# EAGLE design 16nMod4 (EAGLE 6.6.0)

## Sheet 1 of 2: Faders / Jacks / Digital
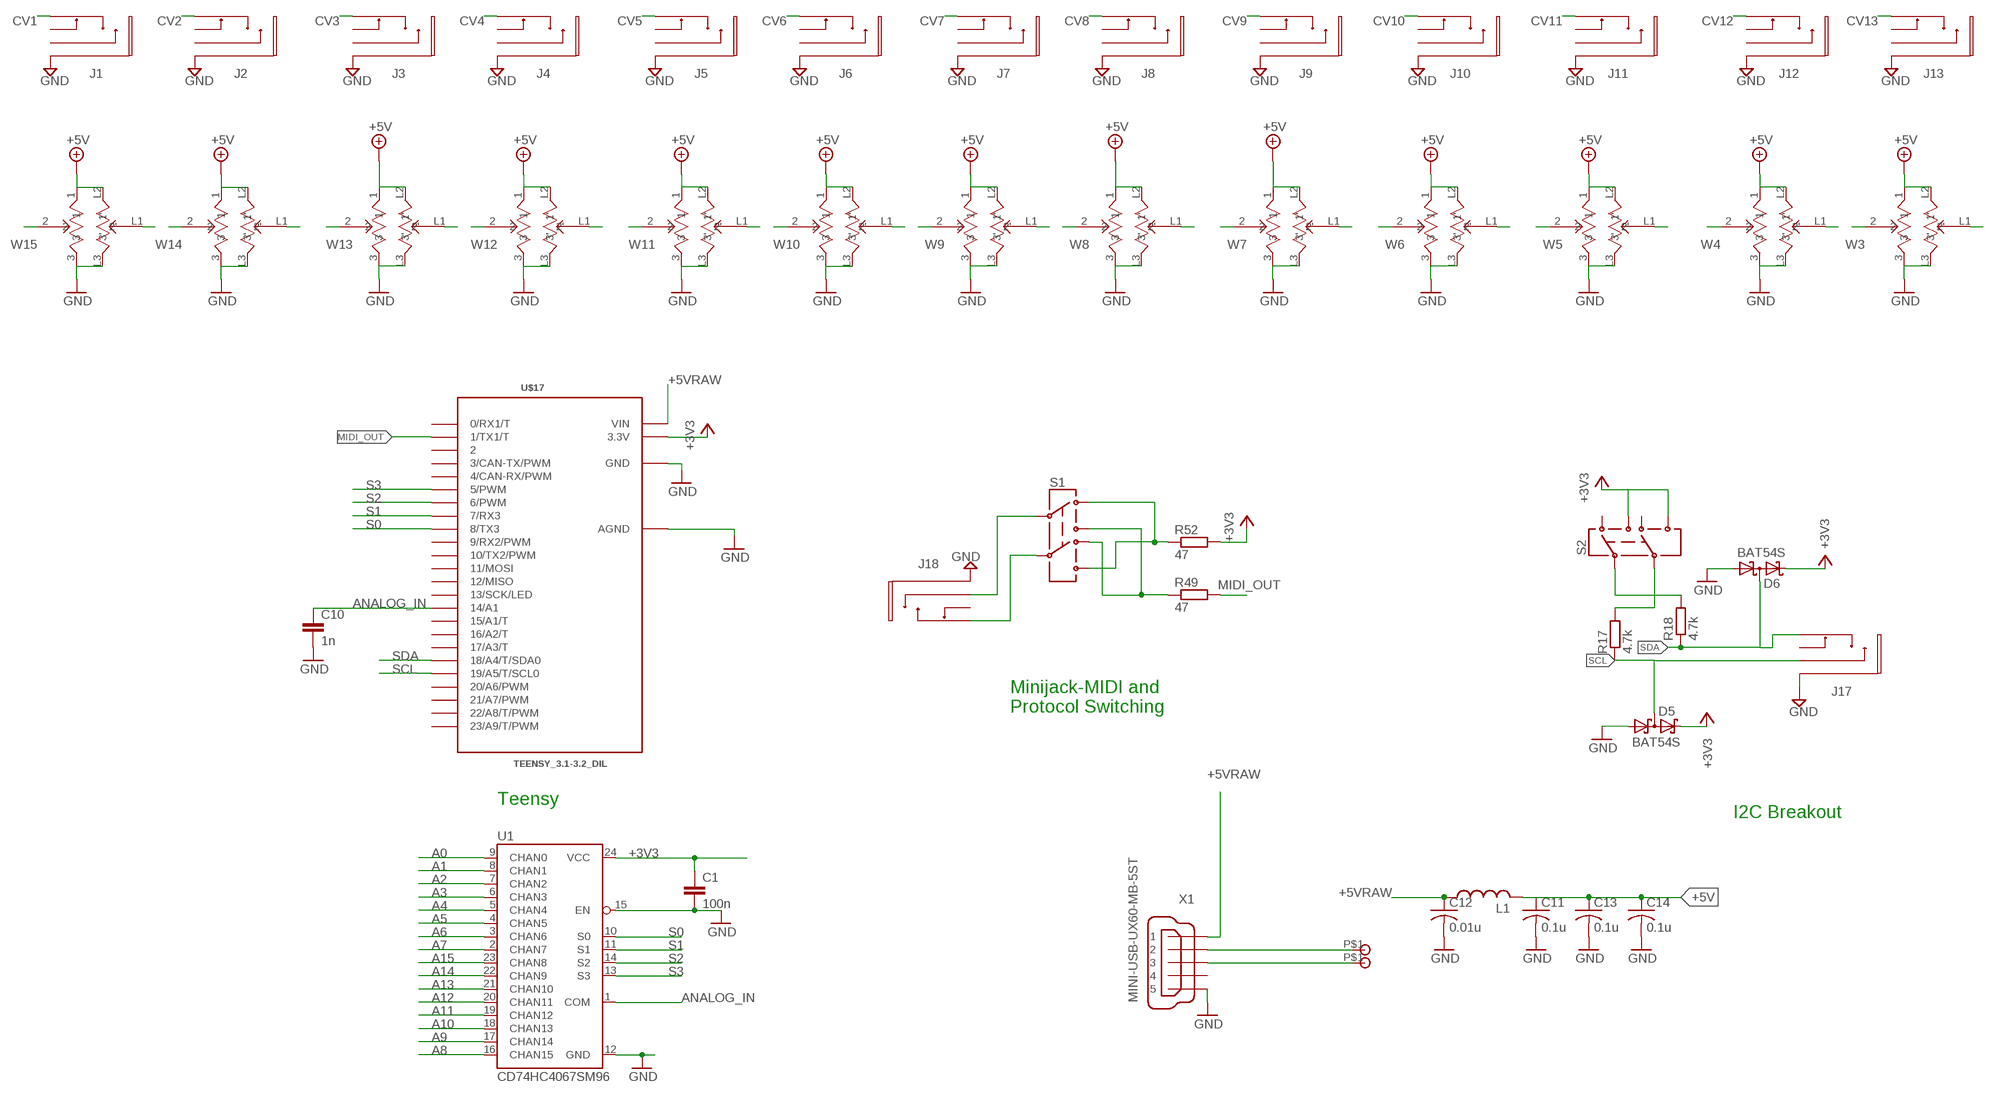
[diagram p0: schematic, sheet 1, part 1 of 2]
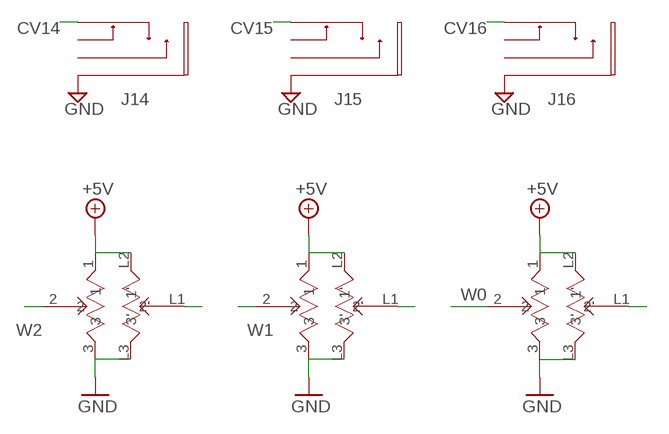
[diagram p1: schematic, sheet 1, part 2 of 2]

### Parts
C1  100n  C-EUC0805  [C0805]
C10  1n  C-EUC0805  [C0805]
C11  0.1u  C-USC0805K  [C0805K]
C12  0.01u  C-USC0805K  [C0805K]
C13  0.1u  C-USC0805K  [C0805K]
C14  0.1u  C-USC0805K  [C0805K]
D5  BAT54S  [SOT23]
D6  BAT54S  [SOT23]
J1  PJ327E  [PJ327]
J2  PJ327E  [PJ327]
J3  PJ327E  [PJ327]
J4  PJ327E  [PJ327]
J5  PJ327E  [PJ327]
J6  PJ327E  [PJ327]
J7  PJ327E  [PJ327]
J8  PJ327E  [PJ327]
J9  PJ327E  [PJ327]
J10  PJ327E  [PJ327]
J11  PJ327E  [PJ327]
J12  PJ327E  [PJ327]
J13  PJ327E  [PJ327]
J14  PJ327E  [PJ327]
J15  PJ327E  [PJ327]
J16  PJ327E  [PJ327]
J17  PJ327E  [PJ327]
J18  PJ327E  [PJ327]
L1  L-USL2012C  [L2012C]
R17  4.7k  R-EU_R0805  [R0805]
R18  4.7k  R-EU_R0805  [R0805]
R49  47  R-EU_R0805  [R0805]
R52  47  R-EU_R0805  [R0805]
S1  SWITCH-DPDT  [JS202011JAQN]
S2  SWITCH-DPDT  [JS202011JAQN]
U1  CD74HC4067SM96  744067SO24  [SOIC127P1030X265-24]
U$1  SLIDEPOT-ALPS-60MM  [RS6011SP600]
U$2  SLIDEPOT-ALPS-60MM  [RS6011SP600]
U$3  SLIDEPOT-ALPS-60MM  [RS6011SP600]
U$4  SLIDEPOT-ALPS-60MM  [RS6011SP600]
U$5  SLIDEPOT-ALPS-60MM  [RS6011SP600]
U$6  SLIDEPOT-ALPS-60MM  [RS6011SP600]
U$7  SLIDEPOT-ALPS-60MM  [RS6011SP600]
U$8  SLIDEPOT-ALPS-60MM  [RS6011SP600]
U$9  SLIDEPOT-ALPS-60MM  [RS6011SP600]
U$10  SLIDEPOT-ALPS-60MM  [RS6011SP600]
U$11  SLIDEPOT-ALPS-60MM  [RS6011SP600]
U$12  SLIDEPOT-ALPS-60MM  [RS6011SP600]
U$13  SLIDEPOT-ALPS-60MM  [RS6011SP600]
U$14  SLIDEPOT-ALPS-60MM  [RS6011SP600]
U$15  SLIDEPOT-ALPS-60MM  [RS6011SP600]
U$16  SLIDEPOT-ALPS-60MM  [RS6011SP600]
U$17  TEENSY_3.1-3.2_DIL  [TEENSY_3.0-3.2&LC_DIL]
U$19  POGO1X  [POGO2MM]
U$20  POGO1X  [POGO2MM]
X1  MINI-USB-UX60-MB-5ST  [UX60-MB-5ST]

### Nets
+3V3: C1.1 D5.2 D6.2 R52.2 S2.P$3 S2.P$7 U1.24(VCC) U$17.3.3V
+5V: C11.1 C13.1 C14.1 L1.2 U$1.1 U$1.L2(1') U$2.1 U$2.L2(1') U$3.1 U$3.L2(1') U$4.1 U$4.L2(1') U$5.1 U$5.L2(1') U$6.1 U$6.L2(1') U$7.1 U$7.L2(1') U$8.1 U$8.L2(1') U$9.1 U$9.L2(1') U$10.1 U$10.L2(1') U$11.1 U$11.L2(1') U$12.1 U$12.L2(1') U$13.1 U$13.L2(1') U$14.1 U$14.L2(1') U$15.1 U$15.L2(1') U$16.1 U$16.L2(1') ; also sheet 2
+5VRAW: C12.1 L1.1 U$17.VIN X1.1
A0: U1.9(CHAN0) ; also sheet 2
A1: U1.8(CHAN1) ; also sheet 2
A2: U1.7(CHAN2) ; also sheet 2
A3: U1.6(CHAN3) ; also sheet 2
A4: U1.5(CHAN4) ; also sheet 2
A5: U1.4(CHAN5) ; also sheet 2
A6: U1.3(CHAN6) ; also sheet 2
A7: U1.2(CHAN7) ; also sheet 2
A8: U1.16(CHAN15) ; also sheet 2
A9: U1.17(CHAN14) ; also sheet 2
A10: U1.18(CHAN13) ; also sheet 2
A11: U1.19(CHAN12) ; also sheet 2
A12: U1.20(CHAN11) ; also sheet 2
A13: U1.21(CHAN10) ; also sheet 2
A14: U1.22(CHAN9) ; also sheet 2
A15: U1.23(CHAN8) ; also sheet 2
ANALOG_IN: C10.1 U1.1(COM) U$17.14/A0(14/A1)
CV1: J1.P$2 ; also sheet 2
CV2: J2.P$2 ; also sheet 2
CV3: J3.P$2 ; also sheet 2
CV4: J4.P$2 ; also sheet 2
CV5: J5.P$2 ; also sheet 2
CV6: J6.P$2 ; also sheet 2
CV7: J7.P$2 ; also sheet 2
CV8: J8.P$2 ; also sheet 2
CV9: J9.P$2 ; also sheet 2
CV10: J10.P$2 ; also sheet 2
CV11: J11.P$2 ; also sheet 2
CV12: J12.P$2 ; also sheet 2
CV13: J13.P$2 ; also sheet 2
CV14: J14.P$2 ; also sheet 2
CV15: J15.P$2 ; also sheet 2
CV16: J16.P$2 ; also sheet 2
D+: U$20.P$1 X1.3
D-: U$19.P$1 X1.2
GND: C1.2 C10.2 C11.2 C12.2 C13.2 C14.2 D5.3 D6.3 J1.P$1 J2.P$1 J3.P$1 J4.P$1 J5.P$1 J6.P$1 J7.P$1 J8.P$1 J9.P$1 J10.P$1 J11.P$1 J12.P$1 J13.P$1 J14.P$1 J15.P$1 J16.P$1 J17.P$1 J18.P$1 U1.12(GND) U1.15(EN) U$1.3 U$1.L3(3') U$2.3 U$2.L3(3') U$3.3 U$3.L3(3') U$4.3 U$4.L3(3') U$5.3 U$5.L3(3') U$6.3 U$6.L3(3') U$7.3 U$7.L3(3') U$8.3 U$8.L3(3') U$9.3 U$9.L3(3') U$10.3 U$10.L3(3') U$11.3 U$11.L3(3') U$12.3 U$12.L3(3') U$13.3 U$13.L3(3') U$14.3 U$14.L3(3') U$15.3 U$15.L3(3') U$16.3 U$16.L3(3') U$17.AGND U$17.GND X1.5 ; also sheet 2
MIDI_OUT: R49.2 U$17.1(1/TX1/T)
N$1: J18.P$2 S1.P$2
N$2: J18.P$3 S1.P$6
N$3: R49.1 S1.P$1 S1.P$7
N$4: R52.1 S1.P$3 S1.P$5
N$11: R17.2 S2.P$2
N$14: R18.2 S2.P$6
S0: U1.10(S0) U$17.8(8/TX3)
S1: U1.11(S1) U$17.7(7/RX3)
S2: U1.14(S2) U$17.6(6/PWM)
S3: U1.13(S3) U$17.5(5/PWM)
SCL: D5.1 J17.P$3 R17.1 U$17.19/A5(19/A5/T/SCL0)
SDA: D6.1 J17.P$2 R18.1 U$17.18/A4(18/A4/T/SDA0)
W0: U$1.2 U$1.L1(2') ; also sheet 2
W1: U$2.2 U$2.L1(2') ; also sheet 2
W2: U$3.2 U$3.L1(2') ; also sheet 2
W3: U$4.2 U$4.L1(2') ; also sheet 2
W4: U$5.2 U$5.L1(2') ; also sheet 2
W5: U$6.2 U$6.L1(2') ; also sheet 2
W6: U$7.2 U$7.L1(2') ; also sheet 2
W7: U$8.2 U$8.L1(2') ; also sheet 2
W8: U$9.2 U$9.L1(2') ; also sheet 2
W9: U$10.2 U$10.L1(2') ; also sheet 2
W10: U$11.2 U$11.L1(2') ; also sheet 2
W11: U$12.2 U$12.L1(2') ; also sheet 2
W12: U$13.2 U$13.L1(2') ; also sheet 2
W13: U$14.2 U$14.L1(2') ; also sheet 2
W14: U$15.2 U$15.L1(2') ; also sheet 2
W15: U$16.2 U$16.L1(2') ; also sheet 2
Unconnected: J1.P$3 J1.P$5 J2.P$3 J2.P$5 J3.P$3 J3.P$5 J4.P$3 J4.P$5 J5.P$3 J5.P$5 J6.P$3 J6.P$5 J7.P$3 J7.P$5 J8.P$3 J8.P$5 J9.P$3 J9.P$5 J10.P$3 J10.P$5 J11.P$3 J11.P$5 J12.P$3 J12.P$5 J13.P$3 J13.P$5 J14.P$3 J14.P$5 J15.P$3 J15.P$5 J16.P$3 J16.P$5 J17.P$5 J18.P$5 S2.P$1 S2.P$5 U$17.0(0/RX1/T) U$17.2 U$17.3(3/CAN-TX/PWM) U$17.4(4/CAN-RX/PWM) U$17.9(9/RX2/PWM) U$17.10(10/TX2/PWM) U$17.11(11/MOSI) U$17.12(12/MISO) U$17.13(13/SCK/LED) U$17.15/A1(15/A1/T) U$17.16/A2(16/A2/T) U$17.17/A3(17/A3/T) U$17.20/A6(20/A6/PWM) U$17.21/A7(21/A7/PWM) U$17.22/A8(22/A8/T/PWM) U$17.23/A9(23/A9/T/PWM) X1.4

### Notes on the sheet
- Minijack-MIDI and 
  Protocol Switching
- Teensy
- I2C Breakout

## Sheet 2 of 2: Buffers / OpAmp power
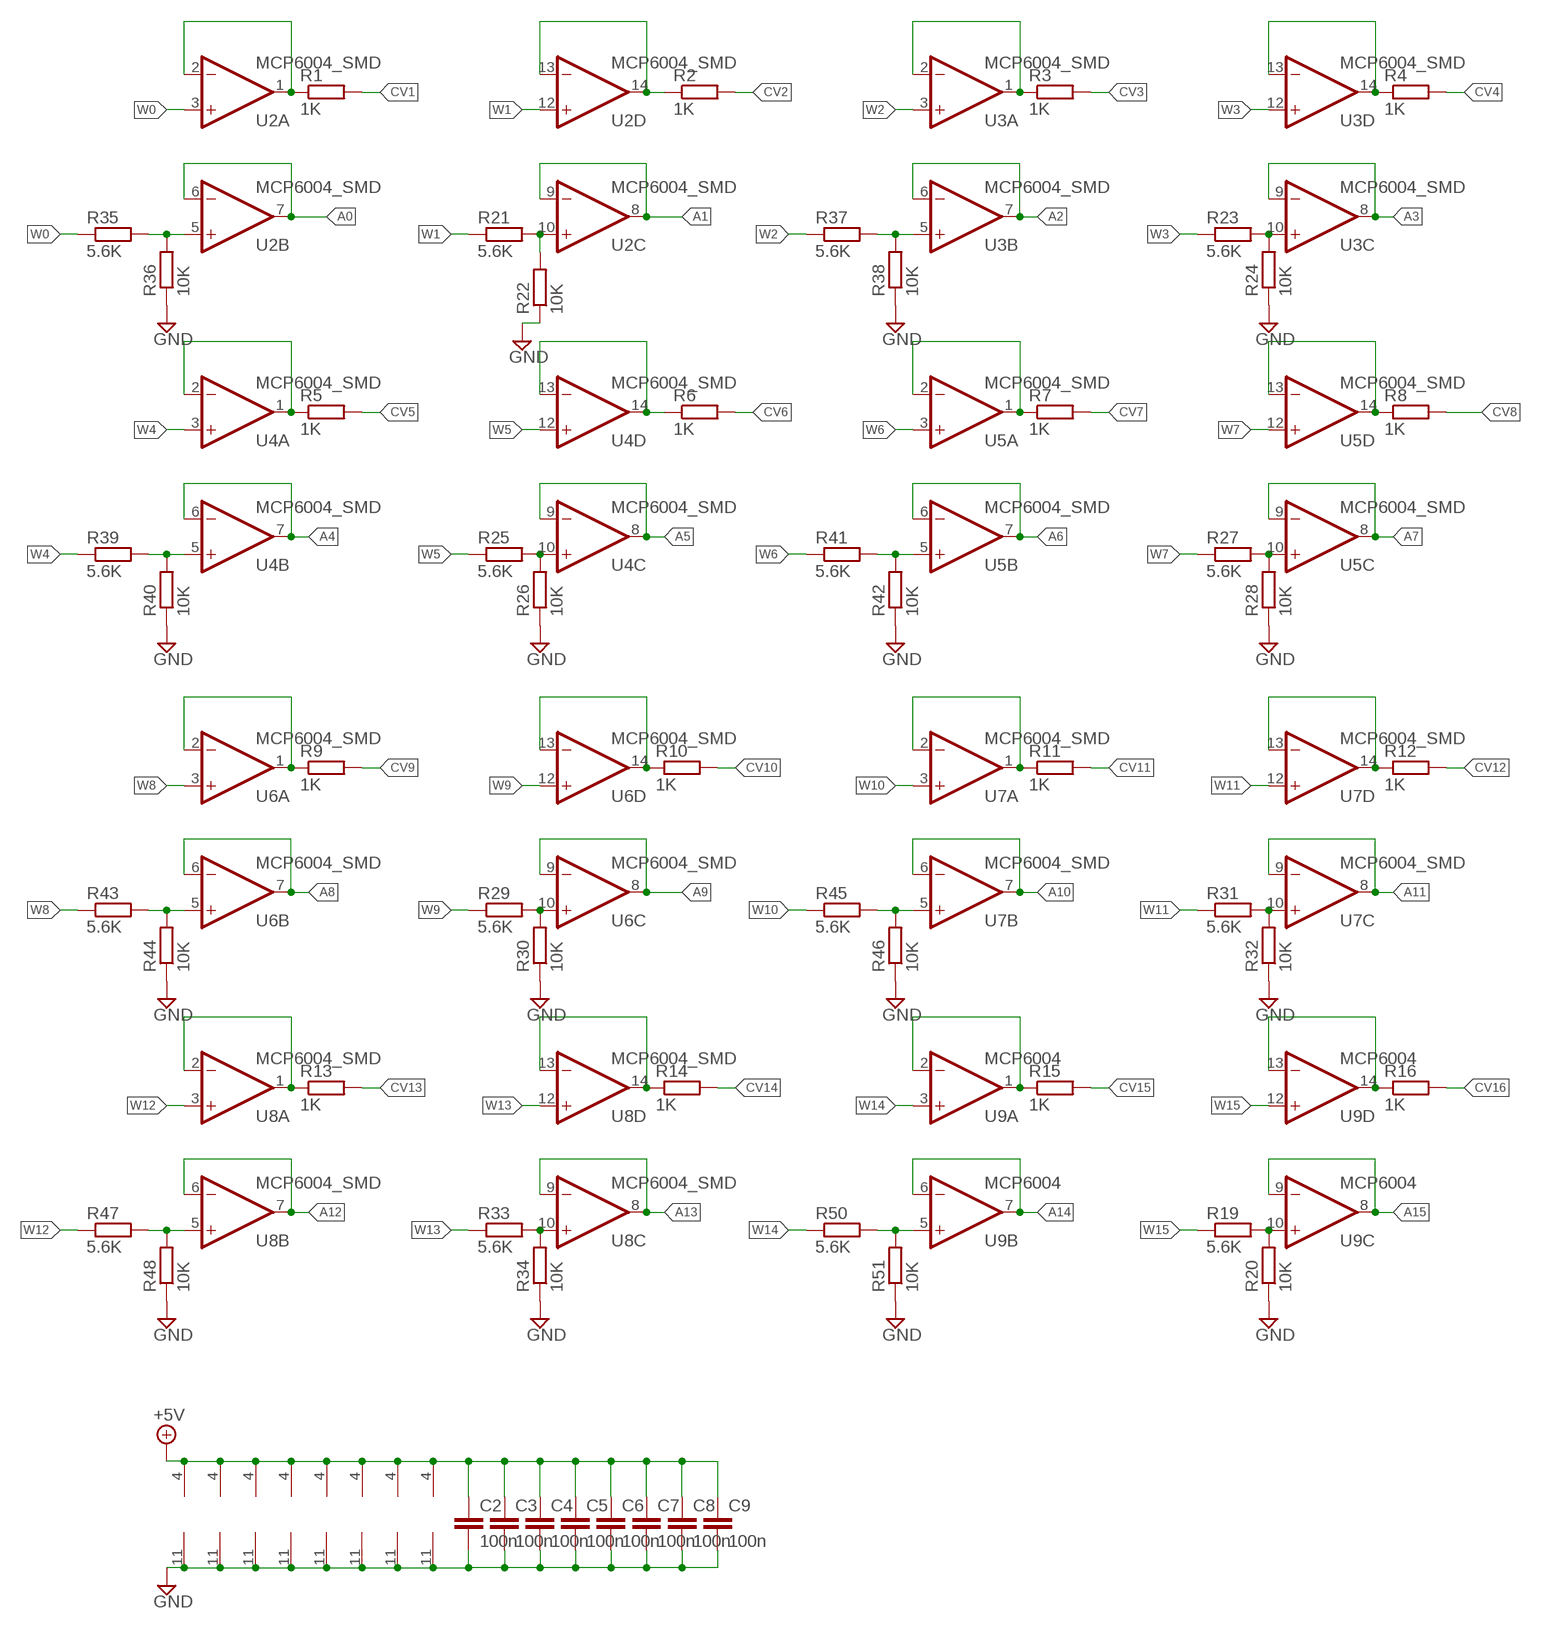
[diagram p2: schematic, sheet 2]

### Parts
C2  100n  C-EUC0805  [C0805]
C3  100n  C-EUC0805  [C0805]
C4  100n  C-EUC0805  [C0805]
C5  100n  C-EUC0805  [C0805]
C6  100n  C-EUC0805  [C0805]
C7  100n  C-EUC0805  [C0805]
C8  100n  C-EUC0805  [C0805]
C9  100n  C-EUC0805  [C0805]
R1  1K  R-EU_R0805  [R0805]
R2  1K  R-EU_R0805  [R0805]
R3  1K  R-EU_R0805  [R0805]
R4  1K  R-EU_R0805  [R0805]
R5  1K  R-EU_R0805  [R0805]
R6  1K  R-EU_R0805  [R0805]
R7  1K  R-EU_R0805  [R0805]
R8  1K  R-EU_R0805  [R0805]
R9  1K  R-EU_R0805  [R0805]
R10  1K  R-EU_R0805  [R0805]
R11  1K  R-EU_R0805  [R0805]
R12  1K  R-EU_R0805  [R0805]
R13  1K  R-EU_R0805  [R0805]
R14  1K  R-EU_R0805  [R0805]
R15  1K  R-EU_R0805  [R0805]
R16  1K  R-EU_R0805  [R0805]
R19  5.6K  R-EU_R0805  [R0805]
R20  10K  R-EU_R0805  [R0805]
R21  5.6K  R-EU_R0805  [R0805]
R22  10K  R-EU_R0805  [R0805]
R23  5.6K  R-EU_R0805  [R0805]
R24  10K  R-EU_R0805  [R0805]
R25  5.6K  R-EU_R0805  [R0805]
R26  10K  R-EU_R0805  [R0805]
R27  5.6K  R-EU_R0805  [R0805]
R28  10K  R-EU_R0805  [R0805]
R29  5.6K  R-EU_R0805  [R0805]
R30  10K  R-EU_R0805  [R0805]
R31  5.6K  R-EU_R0805  [R0805]
R32  10K  R-EU_R0805  [R0805]
R33  5.6K  R-EU_R0805  [R0805]
R34  10K  R-EU_R0805  [R0805]
R35  5.6K  R-EU_R0805  [R0805]
R36  10K  R-EU_R0805  [R0805]
R37  5.6K  R-EU_R0805  [R0805]
R38  10K  R-EU_R0805  [R0805]
R39  5.6K  R-EU_R0805  [R0805]
R40  10K  R-EU_R0805  [R0805]
R41  5.6K  R-EU_R0805  [R0805]
R42  10K  R-EU_R0805  [R0805]
R43  5.6K  R-EU_R0805  [R0805]
R44  10K  R-EU_R0805  [R0805]
R45  5.6K  R-EU_R0805  [R0805]
R46  10K  R-EU_R0805  [R0805]
R47  5.6K  R-EU_R0805  [R0805]
R48  10K  R-EU_R0805  [R0805]
R50  5.6K  R-EU_R0805  [R0805]
R51  10K  R-EU_R0805  [R0805]
U2  MCP6004_SMD  [SO14]
U3  MCP6004_SMD  [SO14]
U4  MCP6004_SMD  [SO14]
U5  MCP6004_SMD  [SO14]
U6  MCP6004_SMD  [SO14]
U7  MCP6004_SMD  [SO14]
U8  MCP6004_SMD  [SO14]
U9  MCP6004  MCP6004_SMD  [SO14]

### Nets
+5V: C2.1 C3.1 C4.1 C5.1 C6.1 C7.1 C8.1 C9.1 U2.4(P:V+) U3.4(P:V+) U4.4(P:V+) U5.4(P:V+) U6.4(P:V+) U7.4(P:V+) U8.4(P:V+) U9.4(P:V+) ; also sheet 1
A0: U2.6(B:-IN) U2.7(B:OUT) ; also sheet 1
A1: U2.8(C:OUT) U2.9(C:-IN) ; also sheet 1
A2: U3.6(B:-IN) U3.7(B:OUT) ; also sheet 1
A3: U3.8(C:OUT) U3.9(C:-IN) ; also sheet 1
A4: U4.6(B:-IN) U4.7(B:OUT) ; also sheet 1
A5: U4.8(C:OUT) U4.9(C:-IN) ; also sheet 1
A6: U5.6(B:-IN) U5.7(B:OUT) ; also sheet 1
A7: U5.8(C:OUT) U5.9(C:-IN) ; also sheet 1
A8: U6.6(B:-IN) U6.7(B:OUT) ; also sheet 1
A9: U6.8(C:OUT) U6.9(C:-IN) ; also sheet 1
A10: U7.6(B:-IN) U7.7(B:OUT) ; also sheet 1
A11: U7.8(C:OUT) U7.9(C:-IN) ; also sheet 1
A12: U8.6(B:-IN) U8.7(B:OUT) ; also sheet 1
A13: U8.8(C:OUT) U8.9(C:-IN) ; also sheet 1
A14: U9.6(B:-IN) U9.7(B:OUT) ; also sheet 1
A15: U9.8(C:OUT) U9.9(C:-IN) ; also sheet 1
CV1: R1.2 ; also sheet 1
CV2: R2.2 ; also sheet 1
CV3: R3.2 ; also sheet 1
CV4: R4.2 ; also sheet 1
CV5: R5.2 ; also sheet 1
CV6: R6.2 ; also sheet 1
CV7: R7.2 ; also sheet 1
CV8: R8.2 ; also sheet 1
CV9: R9.2 ; also sheet 1
CV10: R10.2 ; also sheet 1
CV11: R11.2 ; also sheet 1
CV12: R12.2 ; also sheet 1
CV13: R13.2 ; also sheet 1
CV14: R14.2 ; also sheet 1
CV15: R15.2 ; also sheet 1
CV16: R16.2 ; also sheet 1
GND: C2.2 C3.2 C4.2 C5.2 C6.2 C7.2 C8.2 C9.2 R20.1 R22.1 R24.1 R26.1 R28.1 R30.1 R32.1 R34.1 R36.1 R38.1 R40.1 R42.1 R44.1 R46.1 R48.1 R51.1 U2.11(P:V-) U3.11(P:V-) U4.11(P:V-) U5.11(P:V-) U6.11(P:V-) U7.11(P:V-) U8.11(P:V-) U9.11(P:V-) ; also sheet 1
N$6: R37.2 R38.2 U3.5(B:+IN)
N$7: R23.2 R24.2 U3.10(C:+IN)
N$9: R35.2 R36.2 U2.5(B:+IN)
N$10: R21.2 R22.2 U2.10(C:+IN)
N$12: R39.2 R40.2 U4.5(B:+IN)
N$13: R25.2 R26.2 U4.10(C:+IN)
N$15: R41.2 R42.2 U5.5(B:+IN)
N$16: R27.2 R28.2 U5.10(C:+IN)
N$18: R43.2 R44.2 U6.5(B:+IN)
N$19: R29.2 R30.2 U6.10(C:+IN)
N$21: R45.2 R46.2 U7.5(B:+IN)
N$22: R31.2 R32.2 U7.10(C:+IN)
N$24: R47.2 R48.2 U8.5(B:+IN)
N$25: R33.2 R34.2 U8.10(C:+IN)
N$27: R50.2 R51.2 U9.5(B:+IN)
N$28: R19.2 R20.2 U9.10(C:+IN)
N$300: R1.1 U2.1(A:OUT) U2.2(A:-IN)
N$301: R2.1 U2.13(D:-IN) U2.14(D:OUT)
N$302: R3.1 U3.1(A:OUT) U3.2(A:-IN)
N$303: R4.1 U3.13(D:-IN) U3.14(D:OUT)
N$304: R5.1 U4.1(A:OUT) U4.2(A:-IN)
N$305: R6.1 U4.13(D:-IN) U4.14(D:OUT)
N$306: R7.1 U5.1(A:OUT) U5.2(A:-IN)
N$307: R8.1 U5.13(D:-IN) U5.14(D:OUT)
N$308: R9.1 U6.1(A:OUT) U6.2(A:-IN)
N$309: R10.1 U6.13(D:-IN) U6.14(D:OUT)
N$310: R11.1 U7.1(A:OUT) U7.2(A:-IN)
N$311: R12.1 U7.13(D:-IN) U7.14(D:OUT)
N$312: R13.1 U8.1(A:OUT) U8.2(A:-IN)
N$313: R14.1 U8.13(D:-IN) U8.14(D:OUT)
N$314: R15.1 U9.1(A:OUT) U9.2(A:-IN)
N$315: R16.1 U9.13(D:-IN) U9.14(D:OUT)
W0: R35.1 U2.3(A:+IN) ; also sheet 1
W1: R21.1 U2.12(D:+IN) ; also sheet 1
W2: R37.1 U3.3(A:+IN) ; also sheet 1
W3: R23.1 U3.12(D:+IN) ; also sheet 1
W4: R39.1 U4.3(A:+IN) ; also sheet 1
W5: R25.1 U4.12(D:+IN) ; also sheet 1
W6: R41.1 U5.3(A:+IN) ; also sheet 1
W7: R27.1 U5.12(D:+IN) ; also sheet 1
W8: R43.1 U6.3(A:+IN) ; also sheet 1
W9: R29.1 U6.12(D:+IN) ; also sheet 1
W10: R45.1 U7.3(A:+IN) ; also sheet 1
W11: R31.1 U7.12(D:+IN) ; also sheet 1
W12: R47.1 U8.3(A:+IN) ; also sheet 1
W13: R33.1 U8.12(D:+IN) ; also sheet 1
W14: R50.1 U9.3(A:+IN) ; also sheet 1
W15: R19.1 U9.12(D:+IN) ; also sheet 1

## Library data of the parts
C1-C10 = rcl:C-EU: CAPACITOR, European symbol
C11-C14 = rcl:C-US: CAPACITOR, American symbol
D5 D6 = Raph's Lib:BAT54S: Schottky Diodes Pin connection corrected 2011-05-04 Source: Fairchild .. BAT54.pdf
J1-J18 = Raph's Lib:PJ327E
L1 = rcl:L-US: INDUCTOR, American symbol
R1-R52 = rcl:R-EU_: RESISTOR, European symbol
S1 S2 = SparkFun-Electromechanical:SWITCH-DPDT: DPDT Version of the COM-00597
U1 = foxfield:74*4067: 16-channel analog MUX Datasheet <http://www.sparkfun.com/datasheets/IC/cd74hc4067.pdf> SparkFun Products MP3 Trigger <https://www.sparkfun.com/products/13720> (WIG-13720) SparkFun Analog/Digital MUX Breakout - CD74HC4067 <https://www.sparkfun.com/products/9056> (BOB-09056)
U2-U9 = MusicThingModular:MCP6004: Generic Quad Op Amp
U$1-U$16 = monome:SLIDEPOT-ALPS-60MM
U$17 = Teensy_3_and_LC_Series_Boards_v1.4:TEENSY_3.1-3.2_DIL: Teensy 3.1 or 3.2 in a DIL Layout.
U$19 U$20 = Raph's Lib:POGO1X
X1 = con-hirose:MINI-USB-: MINI USB Connector Source: http://www.hirose.co.jp/cataloge_hp/e24000019.pdf; OC_FARNELL: unknown; OC_NEWARK: unknown

## Board
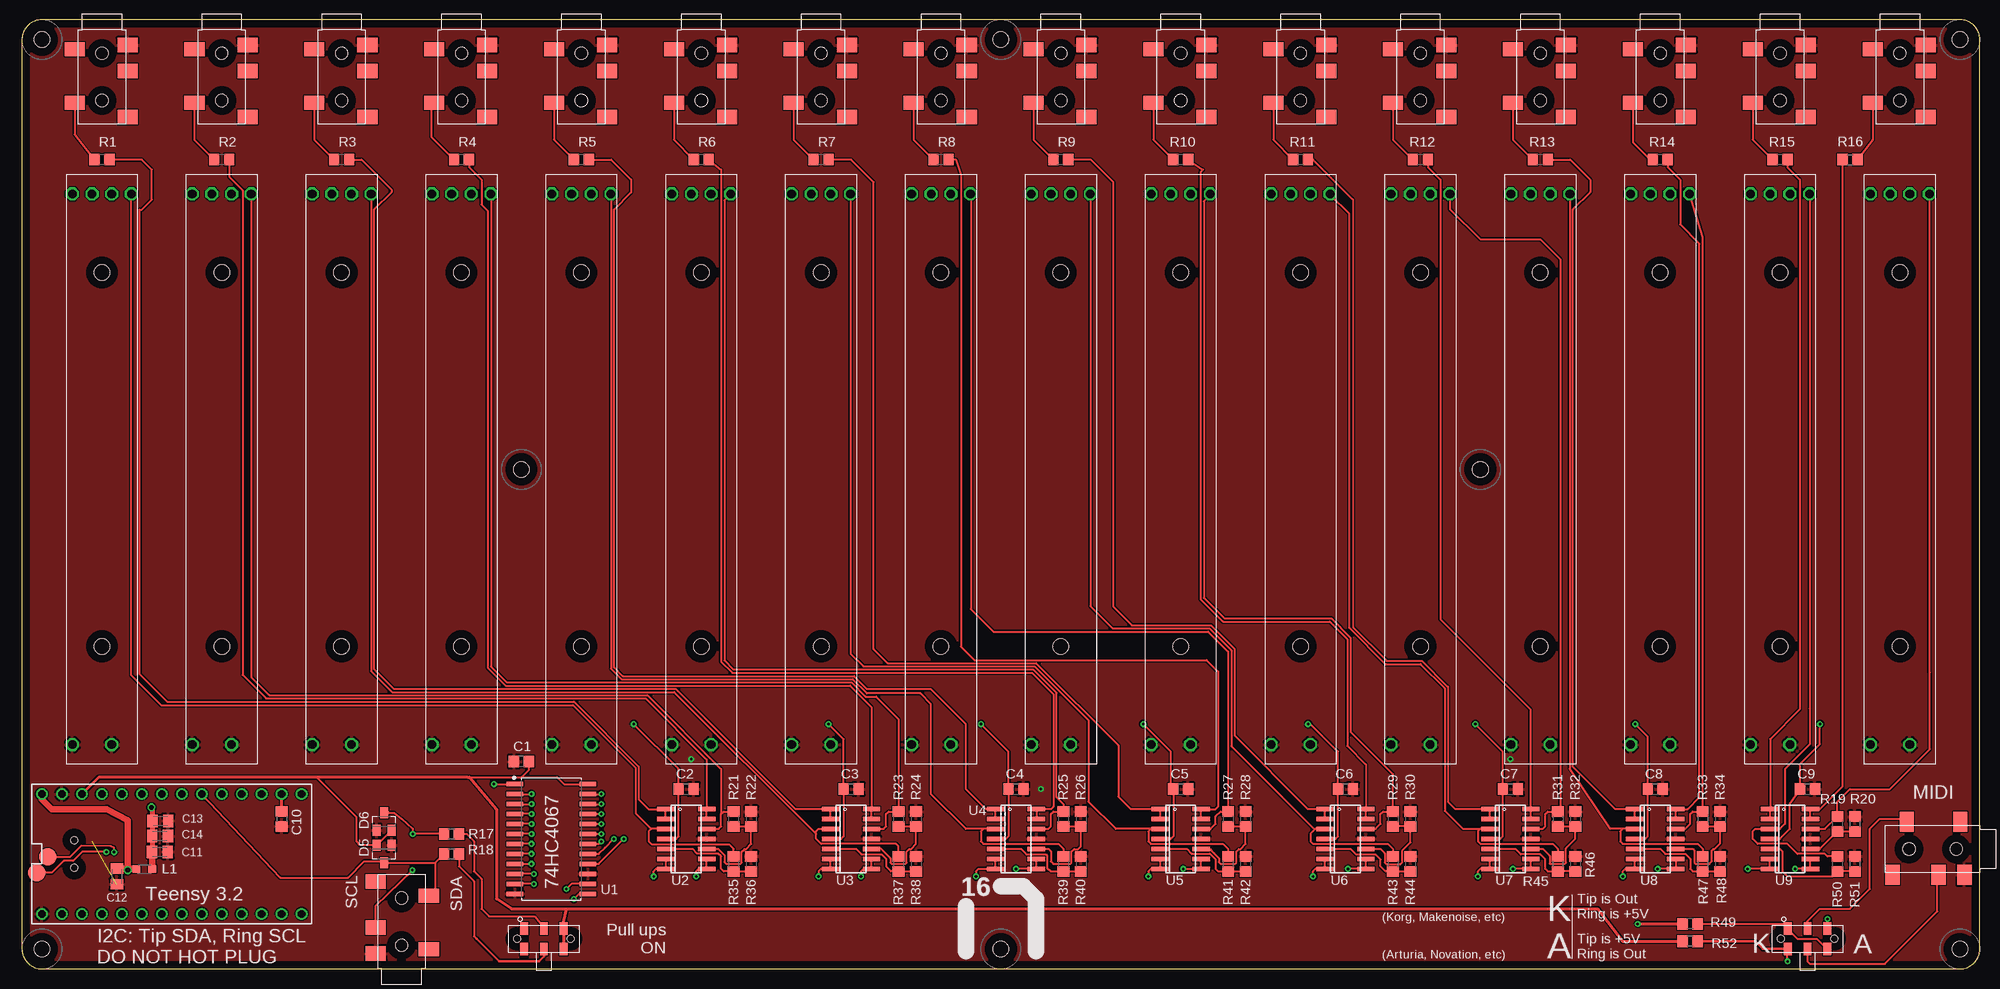
[diagram p3: board, top side]
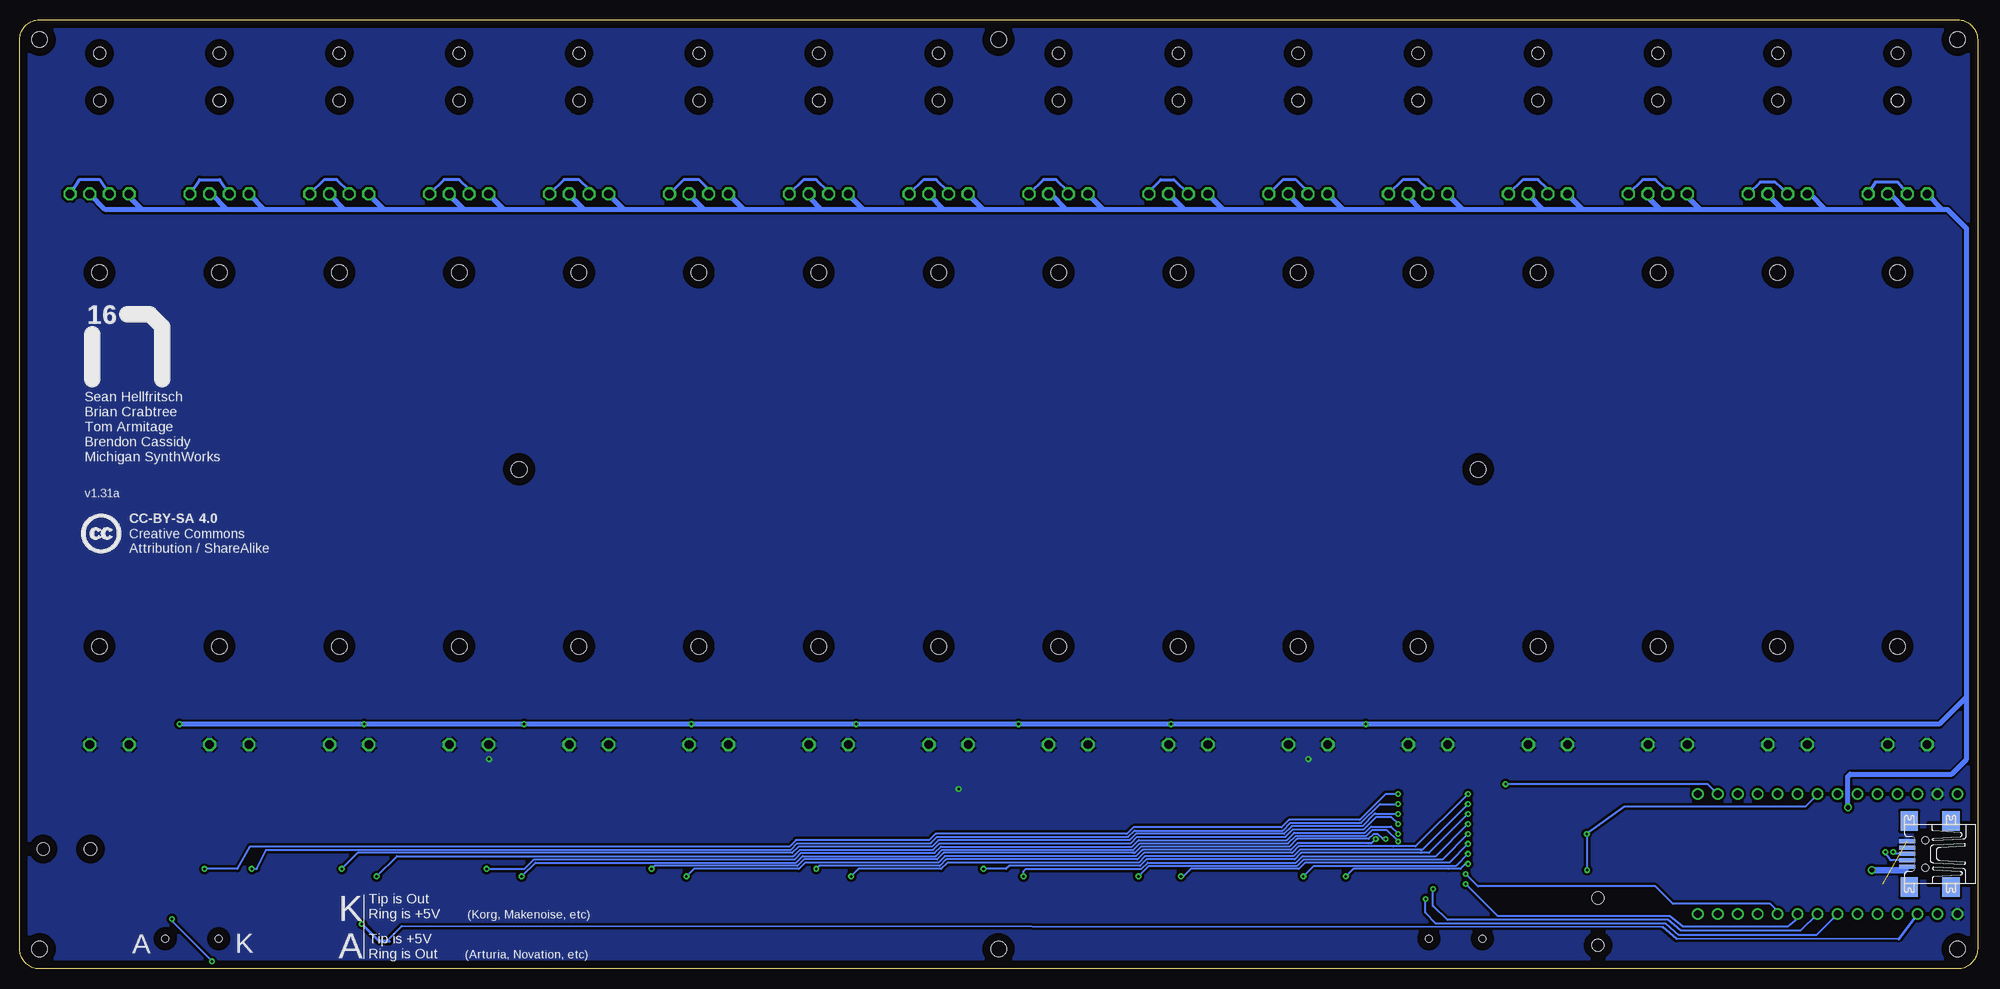
[diagram p4: board, bottom side, seen from below]

Size 248.92 x 120.65 mm. Coordinates in mm from the lower left corner, seen from the top.
Outline: 2.54,0 246.38,0 arc90 248.92,2.54 248.92,118.11 arc90 246.38,120.65 2.54,120.65 arc90 0,118.11 0,2.54 arc90 2.54,0
Copper layers (1*16): Top 0.035mm / dielectric 1.5mm / Bottom 0.035mm
Design rules "PCBway": minimum track width 6mil, minimum drill 0.2mm, track to track 0.15mm, track to pad 0.15mm, pad to pad 0.15mm, via to via 0.15mm, smd to smd 0.15mm, copper to edge 40mil, drill to drill 8mil, minimum pad ring 10mil, minimum via ring 8mil, stop-mask expansion 4mil, vias tented up to drill 25mil, thermal gap 10mil
Holes 2 mm at 2.54,2.54 246.38,2.54 2.54,118.11 246.38,118.11 63.5,63.5 185.42,63.5 124.46,2.54 124.46,118.11

### Footprints (pad centres in the part's own frame; a part is rotated, then mirrored left to right if it is on the bottom)
C0805 = smd 1.3 x 1.5: 1 -0.95,0; 2 0.95,0
C0805K = smd 1.3 x 1.6: 1 -1,0; 2 1,0
SOT23 = smd 1 x 1.4: 1 0,1.1; 2 0.95,-1.1; 3 -0.95,-1.1
PJ327 = smd 1.8 x 2.55: P$1 1.95,3.275; P$2 9.3,-3.475; P$3 5.25,3.275; P$4 2.5,-3.475; P$5 11.1,3.275 | hole 1.575: 3,0; 9,0
L2012C = smd 1 x 1: 1 -1,0; 2 1,0
R0805 = smd 1.3 x 1.5: 1 -0.95,0; 2 0.95,0
JS202011JAQN = smd 1 x 1.6: P$1 -2.5,1.3; P$2 0,1.34; P$3 2.5,1.3; P$5 -2.5,-1.3; P$6 0,-1.3; P$7 2.5,-1.3 | hole 0.9: -3.4,0; 3.4,0
SOIC127P1030X265-24 = smd 2.056 x 0.602: 1 -4.642,6.985; 2 -4.642,5.715; 3 -4.642,4.445; 4 -4.642,3.175; 5 -4.642,1.905; 6 -4.642,0.635; 7 -4.642,-0.635; 8 -4.642,-1.905; 9 -4.642,-3.175; 10 -4.642,-4.445; 11 -4.642,-5.715; 12 -4.642,-6.985; 13 4.642,-6.985; 14 4.642,-5.715; 15 4.642,-4.445; 16 4.642,-3.175; 17 4.642,-1.905; 18 4.642,-0.635; 19 4.642,0.635; 20 4.642,1.905; 21 4.642,3.175; 22 4.642,4.445; 23 4.642,5.715; 24 4.642,6.985
SO14 = smd 0.6 x 2.2: 1 -3.81,-2.6; 2 -2.54,-2.6; 3 -1.27,-2.6; 4 0,-2.6; 5 1.27,-2.6; 6 2.54,-2.6; 7 3.81,-2.6; 8 3.81,2.6; 9 2.54,2.6; 10 1.27,2.6; 11 0,2.6; 12 -1.27,2.6; 13 -2.54,2.6; 14 -3.81,2.6
RS6011SP600 = drill 1.1 octagon: 1 -35,1.25; 2 -35,3.75; 3 35,1.25; L1 -35,-1.25; L2 -35,-3.75; L3 35,-3.75 | hole 2: -25,0; 22.5,0
TEENSY_3.0-3.2&LC_DIL = drill 0.965: 0 -7.62,13.97; 1 -7.62,11.43; 2 -7.62,8.89; 3 -7.62,6.35; 3.3V 7.62,11.43; 4 -7.62,3.81; 5 -7.62,1.27; 6 -7.62,-1.27; 7 -7.62,-3.81; 8 -7.62,-6.35; 9 -7.62,-8.89; 10 -7.62,-11.43; 11 -7.62,-13.97; 12 -7.62,-16.51; 13 7.62,-16.51; 14/A0 7.62,-13.97; 15/A1 7.62,-11.43; 16/A2 7.62,-8.89; 17/A3 7.62,-6.35; 18/A4 7.62,-3.81; 19/A5 7.62,-1.27; 20/A6 7.62,1.27; 21/A7 7.62,3.81; 22/A8 7.62,6.35; 23/A9 7.62,8.89; AGND 7.62,13.97; GND -7.62,16.51; VIN 7.62,16.51
POGO2MM = smd 2.2 x 2.2: P$1 0,0
UX60-MB-5ST = smd 2 x 0.5: 1 2.25,1.6; 2 2.25,0.8; 3 2.25,0; 4 2.25,-0.8; 5 2.25,-1.6 | smd 2.2 x 2.5: M1 -3.3,-4.2; M2 -3.3,4.2; M3 2,4.2; M4 2,-4.2 | hole 0.9: 0,-1.75; 0,1.75

### Placement (x,y rotation side)
C1  63.5,26.35 180 top
C2  84.44,22.86 0 top
C3  105.41,22.86 0 top
C4  126.36,22.86 0 top
C5  147.32,22.86 0 top
C6  168.28,22.86 0 top
C7  189.23,22.86 0 top
C8  207.65,22.86 0 top
C9  227.01,22.86 0 top
C10  33.02,19.05 270 top
C11  17.53,14.87 0 top
C12  12.06,11.75 270 top
C13  17.56,16.88 0 top
C14  17.59,18.82 0 top
D5  46.04,18.73 0 top
D6  46.04,14.61 180 top
J1  10.16,119.38 270 top
J2  25.4,119.38 270 top
J3  40.64,119.38 270 top
J4  55.88,119.38 270 top
J5  71.12,119.38 270 top
J6  86.36,119.38 270 top
J7  101.6,119.38 270 top
J8  116.84,119.38 270 top
J9  132.08,119.38 270 top
J10  147.32,119.38 270 top
J11  162.56,119.38 270 top
J12  177.8,119.38 270 top
J13  193.04,119.38 270 top
J14  208.28,119.38 270 top
J15  223.52,119.38 270 top
J16  238.76,119.38 270 top
J17  48.26,0 90 top
J18  248.92,15.24 180 top
L1  15.56,12.7 0 top
R1  10.16,102.87 180 top
R2  25.4,102.87 180 top
R3  40.64,102.87 180 top
R4  55.88,102.87 180 top
R5  71.12,102.87 180 top
R6  86.36,102.87 180 top
R7  101.6,102.87 180 top
R8  116.84,102.87 180 top
R9  132.08,102.87 180 top
R10  147.32,102.87 180 top
R11  162.56,102.87 180 top
R12  177.8,102.87 180 top
R13  193.04,102.87 180 top
R14  208.28,102.87 180 top
R15  223.52,102.87 180 top
R16  232.41,102.87 0 top
R17  54.61,17.14 0 top
R18  54.61,14.61 0 top
R19  230.82,18.41 270 top
R20  233.04,18.41 270 top
R21  90.49,19.05 270 top
R22  92.71,19.05 270 top
R23  111.44,19.05 270 top
R24  113.67,19.05 270 top
R25  132.4,19.05 270 top
R26  134.62,19.05 270 top
R27  153.35,19.05 270 top
R28  155.57,19.05 270 top
R29  174.31,19.05 270 top
R30  176.53,19.05 270 top
R31  195.26,19.05 270 top
R32  197.49,19.05 270 top
R33  213.68,19.05 270 top
R34  215.9,19.05 270 top
R35  90.49,13.34 270 top
R36  92.71,13.34 270 top
R37  111.44,13.34 270 top
R38  113.67,13.34 270 top
R39  132.4,13.34 270 top
R40  134.62,13.34 270 top
R41  153.35,13.34 270 top
R42  155.57,13.34 270 top
R43  174.31,13.34 270 top
R44  176.53,13.34 270 top
R45  195.26,13.34 270 top
R46  197.49,13.34 270 top
R47  213.68,13.34 270 top
R48  215.9,13.34 270 top
R49  212.09,5.71 180 top
R50  230.82,13.34 270 top
R51  233.04,13.34 270 top
R52  212.09,3.49 180 top
S1  227.01,3.81 0 top
S2  66.36,3.81 0 top
U1  67.31,16.51 0 top
U2  84.45,16.51 270 top
U3  105.41,16.51 270 top
U4  126.36,16.51 270 top
U5  147.32,16.51 270 top
U6  168.28,16.51 270 top
U7  189.23,16.51 270 top
U8  207.65,16.51 270 top
U9  224.79,16.51 270 top
U$1  10.16,63.5 270 top
U$2  25.4,63.5 270 top
U$3  40.64,63.5 270 top
U$4  55.88,63.5 270 top
U$5  71.12,63.5 270 top
U$6  86.36,63.5 270 top
U$7  101.6,63.5 270 top
U$8  116.84,63.5 270 top
U$9  132.08,63.5 270 top
U$10  147.32,63.5 270 top
U$11  162.56,63.5 270 top
U$12  177.8,63.5 270 top
U$13  193.04,63.5 270 top
U$14  208.28,63.5 270 top
U$15  223.52,63.5 270 top
U$16  238.76,63.5 270 top
U$17  19.05,14.61 90 top
U$19  3.28,14.27 0 top
U$20  1.91,12.21 0 top
X1  6.67,14.61 180 bottom

### Tracks (layer width: path | path; a pad name or v marks a point on that pad's centre or on a via)
+3V3
  Top 0.254: 56.66,24.37 63.5,24.37 | 63.5,24.37 68.02,24.37 68.9,23.5 U1.24 | 63.5,24.37 64.45,25.32 C1.1 | D6.2 45.09,15.73 | 45.09,15.73 D5.2 | 45.09,15.73 43.01,15.73 42.55,16.19 42.55,19.29 37.47,24.37
  Top 0.406: U$17.3.3V 9.77,24.37 37.47,24.37 56.66,24.37 56.91,24.37 60.33,20.32 60.33,8.89 62.23,7.62 69.22,7.62 | 210.82,3.81 R52.2 203.52,3.49 200.34,7.62 69.22,7.62 | 69.22,7.62 68.86,5.99 S2.P$3 S2.P$7
+5V  (via drill 0.35, 0.6)
  Top 0.254: v205.1,31.11 206.69,29.52 C8.1 206.69,16.83 206.38,16.51 U8.4 | v184.78,31.11 188.28,27.62 C7.1 188.28,16.83 187.96,16.51 U7.4 | v163.51,31.11 163.83,31.11 167.32,27.62 C6.1 167.32,16.83 167,16.51 U6.4 | v142.56,31.11 146.05,27.62 146.05,23.18 C5.1 146.37,16.83 146.05,16.51 U5.4 | v121.92,31.11 125.42,27.62 C4.1 125.42,16.83 125.09,16.51 U4.4 | v102.55,31.11 104.46,29.21 C3.1 104.46,16.83 104.14,16.51 U3.4 | v77.79,31.11 83.5,25.41 C2.1 83.5,16.84 83.5,16.83 83.19,16.51 U2.4 | U9.4 223.52,16.51 224.79,17.78 224.79,20.95 C9.1 226.06,25.71 226.06,26.04 228.6,28.57 v228.6,31.11
  Top 0.61: 16.54,13.95 16.54,16.88 C13.1 16.56,18.82 C14.1 | C14.1 16.46,18.82 | v16.46,20.53 16.59,20.53 C14.1
  Top 0.813: L1.2 16.54,13.95 C11.1 16.74,14.92
  Bottom 0.61: 1.39,34.61 1.39,26.67 3.3,24.77 16.19,24.77 16.51,24.45 v16.46,20.53 | 1.39,34.61 1.39,94.1 3.81,96.52 4.43,96.52 | 207.65,96.52 217.81,96.52 | 217.81,96.52 222.57,96.52 | 100.97,96.52 111.12,96.52 | 111.12,96.52 115.89,96.52 | 115.89,96.52 126.36,96.52 | 126.36,96.52 131.44,96.52 | 131.44,96.52 141.6,96.52 | 141.6,96.52 147,96.52 | 147,96.52 156.84,96.52 | 156.84,96.52 161.93,96.52 | 161.93,96.52 172.09,96.52 | 172.09,96.52 177.16,96.52 | 177.16,96.52 187.32,96.52 | 187.32,96.52 192.41,96.52 | 192.41,96.52 202.56,96.52 | 202.56,96.52 207.65,96.52 | 80.64,96.52 85.72,96.52 | 85.72,96.52 95.89,96.52 | 95.89,96.52 100.97,96.52 | 4.43,96.52 9.21,96.52 | 9.21,96.52 19.37,96.52 | 19.37,96.52 24.77,96.52 | 24.77,96.52 35.24,96.52 | 35.24,96.52 40.32,96.52 | 40.32,96.52 50.16,96.52 | 50.16,96.52 55.24,96.52 | 55.24,96.52 65.41,96.52 | 65.41,96.52 70.8,96.52 | 70.8,96.52 80.64,96.52 | 222.57,96.52 233.36,96.52 | 233.36,96.52 238.03,96.52 U$16.1 | U$15.1 224.55,98.5 222.57,96.52 | U$14.1 209.53,98.41 207.65,96.52 | 100.97,96.52 100.97,96.61 U$7.1 | 1.39,34.61 4.89,31.11 v77.79,31.11 v102.55,31.11 v121.92,31.11 v142.56,31.11 v163.51,31.11 v184.78,31.11 v205.1,31.11 v228.6,31.11 | 4.43,96.52 U$1.L2 | U$1.1 11.19,98.5 9.21,96.52 | U$2.L2 21.35,98.5 19.37,96.52 | U$2.1 26.65,98.41 24.77,96.52 | U$3.L2 36.89,98.17 35.24,96.52 | U$3.1 41.89,98.09 40.32,96.52 | U$4.L2 52.13,98.48 50.16,96.52 | U$4.1 57.13,98.41 55.24,96.52 | U$5.L2 67.37,98.48 65.41,96.52 | U$5.1 72.37,98.09 70.8,96.52 | U$6.L2 82.61,98.48 80.64,96.52 | U$6.1 87.61,98.41 85.72,96.52 | U$7.L2 97.85,98.48 95.89,96.52 | U$8.L2 113.09,98.48 111.12,96.52 | U$8.1 117.87,98.5 115.89,96.52
  Bottom 0.61: U$9.L2 128.33,98.48 126.36,96.52 | U$9.1 133.33,98.41 131.44,96.52 | U$10.L2 143.57,98.48 141.6,96.52 | U$10.1 148.57,98.09 147,96.52 | U$11.L2 158.81,98.48 156.84,96.52 | U$11.1 163.81,98.41 161.93,96.52 | U$12.L2 174.05,98.48 172.09,96.52 | U$12.1 179.05,98.41 177.16,96.52 | U$13.L2 189.29,98.48 187.32,96.52 | U$13.1 194.29,98.41 192.41,96.52 | U$14.L2 204.53,98.48 202.56,96.52 | U$15.L2 219.77,98.48 217.81,96.52 | U$16.L2 235.01,98.17 233.36,96.52
+5VRAW  (via drill 0.6)
  Top 0.406: v13.44,12.56 12.02,12.56 C12.1
  Top 0.813: C12.1 14.56,12.75 L1.1 | U$17.VIN 2.54,21.59 3.81,20.32 10.79,20.32 13.43,18.88 13.43,13.54 v13.44,12.56
  Bottom 0.406: v13.44,12.56 11.05,12.4 | 9.18,12.53 9.18,12.74 X1.1
  Bottom 0.813: v13.44,12.56 11.06,12.54 9.2,12.54 9.18,12.53
A0  (via drill 0.35)
  Top 0.254: v80.33,11.75 80.33,12.38 80.64,12.7 U2.7 U2.6 | U1.9 v64.77,13.34
  Bottom 0.254: v80.33,11.75 79.38,12.7 67.31,12.7 65.72,12.7 65.09,13.34 v64.77,13.34
A1  (via drill 0.35)
  Top 0.254: v85.72,11.75 85.72,12.38 86.04,12.7 U2.8 U2.9 | v64.77,14.61 U1.8
  Bottom 0.254: v85.72,11.75 84.37,13.11 66.27,13.11 v64.77,14.61
A2  (via drill 0.35)
  Top 0.254: v101.28,11.75 101.28,12.38 101.6,12.7 U3.7 U3.6 | v64.77,15.88 U1.7
  Bottom 0.254: v101.28,11.75 100.97,11.75 100.01,12.7 86.3,12.7 85.49,13.51 72.07,13.51 69.67,13.51 67.13,13.51 v64.77,15.88
A3  (via drill 0.35)
  Top 0.254: v106.68,11.75 106.68,12.38 107,12.7 U3.8 U3.9 | v64.77,17.14 U1.6
  Bottom 0.254: v106.68,11.75 105.32,13.11 86.47,13.11 85.66,13.92 68,13.92 v64.77,17.14
A4  (via drill 0.35)
  Top 0.254: v64.77,18.41 U1.5 | v121.28,11.75 121.28,12.38 121.6,12.7 U4.7 U4.6
  Bottom 0.254: v64.77,18.41 68.86,14.33 85.83,14.33 86.64,13.51 105.49,13.51 106.3,12.7 120.97,12.7 121.28,12.38 v121.28,11.75
A5  (via drill 0.35)
  Top 0.254: v64.77,19.68 U1.4 | U4.9 U4.8 v126.36,12.7
  Bottom 0.254: v126.36,12.7 123.51,12.7 123.1,13.11 106.47,13.11 105.66,13.92 86.81,13.92 85.99,14.73 70.8,14.73 69.72,14.73 v64.77,19.68
A6  (via drill 0.35)
  Top 0.254: v143.19,11.75 143.19,12.38 143.51,12.7 U5.7 U5.6 | U1.3 v64.77,20.95
  Bottom 0.254: 70.8,15.14 70.67,15.14 70.8,15.14 | 70.8,15.14 86.16,15.14 86.97,14.33 90.49,14.33 105.83,14.33 106.64,13.51 130.95,13.51 131.76,12.7 142.24,12.7 v143.19,11.75 | v64.77,20.95 70.59,15.14 70.8,15.14
A7  (via drill 0.35)
  Top 0.254: U1.2 v64.77,22.23 | U5.9 U5.8 v147.64,12.7
  Bottom 0.254: 87.13,14.74 86.97,14.9 86.32,15.56 74.3,15.56 | 74.3,15.56 71.44,15.56 v64.77,22.23 | v147.64,12.7 147.23,13.11 131.93,13.11 131.12,13.92 106.81,13.92 105.99,14.73 87.14,14.73 87.13,14.74 | 87.13,14.74 | 74.3,15.56
A8  (via drill 0.35)
  Top 0.254: v164.15,11.75 164.15,12.38 164.47,12.7 U6.7 U6.6 | U1.16 73.34,13.34 v76.52,16.51
  Bottom 0.254: v164.15,11.75 163.19,12.7 149.86,12.7 149.05,13.51 132.1,13.51 131.29,14.33 106.98,14.33 106.16,15.14 87.31,15.14 86.49,15.96 77.47,15.96 77.06,15.96 v76.52,16.51
A9  (via drill 0.35)
  Top 0.254: U1.17 73.34,14.61 74.14,15.4 v75.25,16.51 | U6.9 U6.8 v168.59,12.7
  Bottom 0.254: v168.59,12.7 168.19,13.11 150.03,13.11 149.22,13.92 132.27,13.92 131.46,14.73 107.31,14.73 107.14,14.73 106.33,15.54 87.48,15.54 86.52,16.51 77.41,16.51 76.78,17.14 76.26,17.14 75.62,16.51 v75.25,16.51
A10  (via drill 0.35)
  Top 0.254: v185.1,11.75 185.1,12.38 185.42,12.7 U7.7 U7.6 | U1.18 73.34,15.88 v73.66,16.19
  Bottom 0.254: v185.1,11.75 183.34,13.51 150.2,13.51 149.38,14.33 132.44,14.33 131.62,15.14 107.31,15.14 106.5,15.95 87.65,15.95 86.68,16.92 77.7,16.92 76.95,17.66 75.13,17.66 v73.66,16.19
A11  (via drill 0.35)
  Top 0.254: U1.19 v73.66,17.14 | U7.9 U7.8 v189.55,12.7
  Bottom 0.254: v189.55,12.7 184.72,12.7 183.51,13.92 150.37,13.92 149.55,14.73 132.6,14.73 131.79,15.54 107.48,15.54 106.67,16.36 87.82,16.36 86.85,17.32 77.87,17.32 77.12,18.07 74.58,18.07 v73.66,17.14
A12  (via drill 0.35)
  Top 0.254: v203.52,11.75 203.52,12.38 203.84,12.7 U8.7 U8.6 | U1.20 v73.66,18.41
  Bottom 0.254: v203.52,11.75 200.94,14.33 150.53,14.33 149.72,15.14 132.77,15.14 131.96,15.95 107.65,15.95 106.84,16.76 87.98,16.76 87.02,17.73 78.03,17.73 76.49,19.28 74.52,19.28 v73.66,18.41
A13  (via drill 0.35)
  Top 0.254: U1.21 v73.66,19.68 | U8.9 U8.8 v207.96,12.7
  Bottom 0.254: v207.96,12.7 205.93,14.73 150.7,14.73 149.89,15.54 132.94,15.54 132.13,16.36 107.82,16.36 107,17.17 88.15,17.17 87.19,18.14 78.2,18.14 76.65,19.68 76.52,19.68 v73.66,19.68
A14  (via drill 0.35)
  Top 0.254: v219.39,12.7 U9.7 U9.6 | U1.22 v73.66,20.95
  Bottom 0.254: v73.66,20.95 75.96,20.95 78.37,18.54 87.36,18.54 88.32,17.58 107.17,17.58 107.99,16.76 132.3,16.76 133.11,15.95 150.06,15.95 150.87,15.14 217.59,15.14 218.76,12.7 v219.39,12.7
A15  (via drill 0.35)
  Top 0.254: U1.23 v73.66,22.23 | U9.9 U9.8 v225.43,12.7
  Bottom 0.254: v225.43,12.7 221.24,12.7 219.66,15.54 151.04,15.54 150.23,16.36 133.28,16.36 132.47,17.17 108.15,17.17 107.34,17.98 88.49,17.98 87.53,18.95 78.54,18.95 75.26,22.23 v73.66,22.23
ANALOG_IN  (via drill 0.35)
  Top 0.254: v60.01,23.5 U1.1
  Top 0.406: C10.1 U$17.14/A0
  Bottom 0.254: U$17.14/A0 34.29,23.5 v60.01,23.5
CV1
  Top 0.254: J1.P$2 6.68,106.03 R1.2
CV2
  Top 0.254: J2.P$2 21.93,105.39 R2.2
CV3
  Top 0.254: J3.P$2 37.16,105.39 R3.2
CV4
  Top 0.254: R4.2 52.07,105.73 52.07,110.49 52.41,110.16 J4.P$2
CV5
  Top 0.254: J5.P$2 67.64,105.39 R5.2
CV6
  Top 0.254: J6.P$2 82.89,105.39 R6.2
CV7
  Top 0.254: J7.P$2 98.12,105.39 R7.2
CV8
  Top 0.254: J8.P$2 113.36,105.39 R8.2
CV9
  Top 0.254: J9.P$2 128.6,105.39 R9.2
CV10
  Top 0.254: J10.P$2 143.84,105.39 R10.2
CV11
  Top 0.254: J11.P$2 159.09,105.39 R11.2
CV12
  Top 0.254: J12.P$2 174.32,105.39 R12.2
CV13
  Top 0.254: J13.P$2 189.56,105.39 R13.2
CV14
  Top 0.254: J14.P$2 204.81,105.08 207.01,102.87 R14.2
CV15
  Top 0.254: J15.P$2 220.04,105.39 R15.2
CV16
  Top 0.254: J16.P$2 235.28,105.39 R16.2
D+  (via drill 0.33)
  Top 0.254: v10.72,14.86 7.64,14.86 6.67,13.89 6.65,13.89 6.5,13.74 5.32,13.74 3.8,12.22 U$20.P$1
  Bottom 0.254: X1.3 10.83,14.61 v10.72,14.86
D-  (via drill 0.33)
  Top 0.254: v11.71,14.83 11.72,15.42 11.31,15.61 7.51,15.62 6.08,14.19 3.25,14.19 U$19.P$1
  Top 0.406: 2.86,14.58 U$19.P$1
  Bottom 0.254: X1.2 11.03,13.8 v11.71,14.83
GND  (via drill 0.35)  (1 unrouted)
  other vias: 189.23,26.67 85.09,26.67 129.54,22.86
  pour Bottom (isolate 0.305): 0,0 249,0 248.69,118.12 arc90 246.15,120.65 2.54,120.65 arc90 0,118.11
  pour Top: 0,-0.32 248.92,-0.32 248.92,118.11 arc90 246.38,120.65 2.54,120.65 arc90 0,118.11
MIDI_OUT  (via drill 0.33)
  Top 0.406: v205.42,5.71 R49.2
  Bottom 0.254: 10.01,3.78 38.27,3.82 40.02,5.28 200.34,5.4
  Bottom 0.305: U$17.1 10.01,3.78 | 200.34,5.4 202.25,3.49
  Bottom 0.406: 201.93,3.49 202.25,3.49 203.2,3.49 v205.42,5.71
N$1
  Top 0.254: S1.P$2 227.01,6.03 228.6,7.62 232.41,7.62 234.95,10.16 234.95,17.78 236.22,19.05 239.28,19.05 J18.P$2
N$2
  Top 0.254: 227.01,3.17 S1.P$6 227.01,0.95 227.33,0.64 236.85,0.64 243.52,7.3 243.52,12.38 243.84,12.7 243.84,12.13 J18.P$3
N$3
  Top 0.254: R49.1 223.91,5.71 S1.P$1 224.76,5.11 224.76,4.79 225.74,3.81 228.21,3.81 S1.P$7
N$4  (via drill 0.33)
  Top 0.254: S1.P$3 229.51,6.31 v229.55,6.35 | v224.47,0.95 224.47,2.47 S1.P$5
  Top 0.305: R52.1 220.34,3.49 221.3,2.54 224.48,2.54 S1.P$5
  Bottom 0.254: v229.55,6.35 229.55,6.03 v224.47,0.95
N$6
  Top 0.254: R38.2 R37.2 110.49,12.38 109.86,13.02 109.86,13.97 109.28,14.55 106.74,14.55 106.05,15.24 U3.5
N$7
  Top 0.254: R23.2 R24.2 113.67,15.88 113,15.21 112.8,15.21 112.47,14.89 112.47,13.52 112.29,13.34 110.81,13.34 110.79,13.36 110.58,13.36 110.41,13.52 110.41,14.05 109.22,15.24 U3.10
N$9
  Top 0.254: R36.2 R35.2 89.22,12.38 88.9,12.7 88.9,14.29 88.53,14.66 85.84,14.66 85.26,15.24 U2.5
N$10
  Top 0.254: R21.2 90.81,18.1 92.39,18.1 | 92.39,18.1 R22.2 | 92.39,18.1 92.71,17.78 92.71,15.88 92.05,15.21 91.84,15.21 91.52,14.89 91.52,13.52 91.33,13.34 89.53,13.34 89.31,13.56 89.31,14.46 88.52,15.24 U2.10
N$11
  Top 0.254: R17.2 56.52,17.14 57.47,16.19 57.47,12.38 58.42,11.43 58.42,7.62 59.37,6.67 65.16,6.67 S2.P$2
N$12
  Top 0.254: R40.2 R39.2 130.81,12.38 130.34,12.85 130.34,14.39 130.18,14.55 127.69,14.55 127,15.24 U4.5
N$13
  Top 0.254: R25.2 R26.2 134.62,15.56 134.28,15.21 133.75,15.21 133.43,14.89 133.43,13.52 133.24,13.34 131.13,13.34 130.81,13.65 130.81,14.92 130.49,15.24 U4.10
N$14
  Top 0.254: R18.2 55.56,13.02 57.47,11.11 57.47,4.13 57.78,3.81
  Top 0.305: S2.P$6 66.36,1.59 65.72,0.95 60.64,0.95 57.78,3.81
N$15
  Top 0.254: R42.2 R41.2 152.09,12.38 152.08,12.38 151.76,12.7 151.76,13.92 151.03,14.66 148.91,14.66 148.7,14.66 148.12,15.24 U5.5
N$16
  Top 0.254: R27.2 R28.2 155.57,15.88 154.91,15.21 154.71,15.21 154.38,14.89 154.38,13.52 154.2,13.34 152.4,13.34 152.17,13.56 152.17,14.09 151.55,14.71 151.23,15.03 151.02,15.24 U5.10
N$18
  Top 0.254: R44.2 R43.2 173.35,12.38 172.72,13.02 172.72,13.92 172.09,14.55 169.6,14.55 168.91,15.24 U6.5
N$19
  Top 0.254: R29.2 R30.2 176.53,16.08 175.5,15.05 175.5,13.58 175.24,13.31 173.48,13.31 173.28,13.52 173.28,14.68 172.72,15.24 U6.10
N$21
  Top 0.254: R46.2 R45.2 193.99,12.38 193.68,12.7 193.68,13.92 193.05,14.55 190.56,14.55 189.87,15.24 U7.5
N$22
  Top 0.254: R31.2 R32.2 197.49,16.51 196.29,15.32 196.29,13.52 196.11,13.34 194.31,13.34 194.23,13.41 194.23,14.36 193.36,15.24 U7.10
N$24
  Top 0.254: R48.2 R47.2 212.41,12.38 212.09,12.7 212.09,13.97 211.46,14.61 208.91,14.61 208.28,15.24 U8.5
N$25
  Top 0.254: R33.2 R34.2 215.9,15.95 215.16,15.21 215.03,15.21 214.87,15.05 214.87,13.68 214.54,13.36 212.81,13.36 212.65,13.52 212.65,15 212.41,15.24 U8.10
N$27
  Top 0.254: R51.2 R50.2 230.19,11.75 224.47,11.75 223.84,12.38 223.84,14.92 223.52,15.24 U9.5
N$28
  Top 0.254: R20.2 R19.2 228.6,15.24 U9.10
N$300
  Top 0.254: 81.86,20.26 79.69,20.26 78.42,21.53 78.42,25.72 70.17,33.97 18.44,33.97 14.95,37.47 14.95,96.52 15.24,96.52 16.51,97.79 16.51,101.6 15.24,102.87 11.43,102.87 11.43,103.19 R1.1 | U2.2 81.86,20.26 | U2.1 81.86,20.26
N$301
  Top 0.254: U2.13 U2.14 87.06,26.61 79.29,34.38 31.03,34.38 28.05,37.36 28.05,98.96 26.35,100.65 R2.1
N$302
  Top 0.254: U3.2 U3.1 98.36,20.32 83.09,35.6 47.27,35.6 44.8,38.07 44.8,96.55 46.99,98.74 46.99,99.06 43.18,102.87 R3.1
N$303
  Top 0.254: U3.13 U3.14 108.01,33.28 105.28,36.01 61.47,36.01 59.22,38.25 59.22,96.35 58.42,97.16 58.42,100.33 56.83,101.92 R4.1
N$304
  Top 0.254: U4.1 123.51,20.32 | 123.51,20.32 122.56,20.32 120.02,22.86 120.02,31.11 115.57,35.56 107.45,35.56 105.79,37.22 76.38,37.22 75.28,38.33 75.28,96.52 77.47,98.71 77.47,100.33 74.93,102.87 R5.1 | U4.2 123.77,20.06 123.51,20.32
N$305
  Top 0.254: R6.1 88.9,101.6 88.9,39.05 90.32,37.63 128.42,37.63 131.13,34.92 131.13,20.64 130.81,20.32 U4.14 U4.13
N$306
  Top 0.254: U5.2 U5.1 140.97,20.32 139.38,21.91 139.38,28.39 128.93,38.85 110.06,38.85 108.27,40.64 108.27,100.01 105.41,102.87 R7.1
N$307
  Top 0.254: R8.1 118.75,102.87 119.38,100.97 119.38,40.96 121.08,39.26 150.61,39.26 152.08,37.78 152.08,20.64 151.76,20.32 150.18,20.32 | U5.14 150.18,20.32 | U5.13 149.92,20.06 150.18,20.32
N$308
  Top 0.254: U6.2 U6.1 163.51,20.32 154.16,29.67 154.16,40.66 151.15,43.67 141.11,43.67 138.75,46.03 138.75,100.01 135.89,102.87 R9.1
N$309
  Top 0.254: R10.1 150.18,101.6 149.86,101.28 149.86,46.99 152.72,44.13 166.28,44.13 168.5,41.91 168.5,28.35 170.88,25.98 U6.14 U6.13
N$310
  Top 0.254: U7.2 U7.1 182.25,20.32 181.29,21.27 181.29,35.88 181.23,35.88 177.97,39.14 173.52,39.14 169.23,43.44 169.23,97.79 164.15,102.87 R11.1
N$311
  Top 0.254: U7.13 U7.14 191.77,20.38 191.77,33.02 180.34,44.45 180.34,100.33 178.75,101.92 R12.1
N$312
  Top 0.254: U8.2 U8.1 202.56,20.32 197.2,25.69 197.2,96.55 199.39,98.74 199.39,100.33 196.85,102.87 R13.1
N$313
  Top 0.254: U8.14 210.5,20.32 | 210.5,20.32 211.77,20.32 213.27,21.82 213.27,92.17 210.82,94.61 210.82,100.33 209.23,101.92 R14.1 | U8.13 210.25,20.06 210.5,20.32
N$314
  Top 0.254: U9.2 U9.1 222.25,20.38 222.25,29.21 226.06,33.02 226.06,100.33 224.47,101.92 R15.1
N$315
  Top 0.254: U9.13 U9.14 228.6,20.32 231.46,23.18 R16.1
S0  (via drill 0.33)
  Top 0.254: v65.09,12.06 U1.10
  Bottom 0.254: U$17.8 25.4,7.3 26.35,8.26 38.73,8.26 40.96,10.48 63.5,10.48 v65.09,12.06
S1  (via drill 0.33)
  Top 0.254: v65.09,10.79 U1.11
  Bottom 0.254: U$17.7 22.86,6.35 24.15,5.38 37.49,5.38 39.09,6.7 61,6.7 v65.09,10.79
S2  (via drill 0.33)
  Top 0.254: U1.14 69.85,10.79 v69.22,10.16
  Bottom 0.254: 69.22,7.94 69.22,8.04 | 69.22,8.04 v69.22,10.16 | U$17.6 22.51,4.86 37.74,4.86 39.37,6.23 67.4,6.23 69.22,8.04
S3  (via drill 0.33)
  Top 0.254: v70.17,8.89 70.8,9.53 U1.13
  Bottom 0.254: U$17.5 20.47,4.29 37.96,4.29 39.64,5.75 68.86,5.75 70.18,7.16 70.18,8.87 v70.17,8.89
SCL  (via drill 0.33)
  Top 0.254: R17.1 v49.68,17.14 49.68,17.84 48.26,19.05 47.32,19.83 46.67,19.83 | D5.1 46.67,19.83 | 46.5,20 46.67,19.83 | J17.P$3 44.96,8.01 v49.64,12.55
  Bottom 0.254: U$17.19/A5 21.91,20.64 44.91,20.64 v49.68,17.14 49.68,12.87 v49.64,12.55
SDA
  Top 0.254: 52.56,13.51 D6.1 45.89,13.65 43.5,13.65 41.45,11.6 32.85,11.6 U$17.18/A4 | 52.56,13.51 R18.1 | 52.56,13.51 52.56,10.12 J17.P$2
W0
  Top 0.254: R35.1 90.49,15.24 89.91,15.82 80.07,15.82 79.69,16.19 79.69,17.46 80.01,17.78 | U$1.2 13.91,37.3 17.68,33.53 70.04,33.53 78.02,25.55 78.02,19.77 80.01,17.78 | U2.3 80.01,17.78
  Bottom 0.406: U$1.L1 10.16,100.01 13.02,100.01 U$1.2
W1
  Top 0.254: 88.9,19.68 89.22,20 R21.1 | 88.9,19.68 88.9,18.1 88.58,17.78 U2.12 | 88.9,19.68 88.9,25.4 79.52,34.78 31.43,34.78 29.15,37.07 U$2.2
  Bottom 0.406: U$2.L1 25.72,100.01 27.64,100.01 U$2.2
W2
  Top 0.254: R37.1 111.44,15.56 111.12,15.88 101.6,15.88 100.97,16.51 100.97,17.14 | 100.97,17.14 100.97,17.46 101.28,17.78 U3.3 | U$3.2 44.39,37.84 47.04,35.19 82.92,35.19 100.97,17.14
  Bottom 0.406: U$3.L1 39.39,98.76 40.96,100.33 42.56,100.33 U$3.2
W3
  Top 0.254: U$4.2 59.63,38.42 61.64,36.41 105.45,36.41 107.25,34.61 108.58,34.61 111.44,31.75 R23.1 110.17,20 109.86,19.68 109.86,18.1 109.54,17.78 U3.12
  Bottom 0.406: U$4.L1 54.63,99.08 55.88,100.33 57.8,100.33 U$4.2
W4
  Top 0.254: 122.24,17.78 121.92,17.46 121.92,16.19 122.24,15.88 131.76,15.88 132.4,15.24 R39.1 | U$5.2 74.87,38.16 76.21,36.82 105.62,36.82 107.42,35.01 114.21,35.01 115.57,33.66 115.57,22.23 120.02,17.78 122.24,17.78 | U4.3 122.24,17.78
  Bottom 0.406: U$5.L1 69.87,99.08 71.12,100.33 73.04,100.33 U$5.2
W5
  Top 0.254: U$6.2 89.31,97.7 89.31,39.22 90.49,38.04 128.59,38.04 131.53,35.09 131.53,21.82 132.4,20.95 R25.1 131.13,20 130.81,19.68 130.81,18.1 130.49,17.78 U4.12
  Bottom 0.406: U$6.L1 85.11,98.76 86.68,100.33 88.28,100.33 U$6.2
W6
  Top 0.254: R41.1 153.35,15.24 152.72,15.88 143.51,15.88 143.19,16.19 143.19,17.46 143.51,17.78 U5.3 139.06,17.78 135.57,21.27 135.57,31.63 128.76,38.44 106.97,38.44 105.35,40.06 U$7.2
  Bottom 0.406: U$7.2 105.35,98.8 103.82,100.33 102.18,100.33 U$7.L1
W7
  Top 0.254: U$8.2 120.65,98.44 120.65,45.72 123.51,42.86 150.81,42.86 153.35,40.32 R27.1 152.4,20 151.76,19.37 151.76,18.41 151.13,17.78 U5.12
  Bottom 0.406: U$8.L1 115.59,98.76 117.16,100.33 118.76,100.33 U$8.2
W8
  Top 0.254: R43.1 174.31,15.24 173.67,15.88 164.15,15.88 163.83,16.19 163.83,17.14 164.47,17.78 | 164.47,17.78 164.29,17.78 153.76,28.31 153.76,40.49 150.98,43.27 138.66,43.27 135.83,46.1 U$9.2 | U6.3 164.47,17.78
  Bottom 0.406: U$9.L1 130.83,98.76 132.4,100.33 134,100.33 U$9.2
W9
  Top 0.254: U$10.2 151.07,98.36 150.27,97.56 150.27,47.16 152.89,44.54 166.45,44.54 168.91,42.08 168.91,30.16 174.31,24.77 R29.1 173.04,20 172.72,19.68 172.72,18.41 172.09,17.78 U6.12
  Bottom 0.406: U$10.L1 146.07,98.76 147.64,100.33 149.24,100.33 U$10.2
W10
  Top 0.254: U7.3 185.42,17.78 | 185.42,17.78 185.1,17.46 185.1,16.19 185.42,15.88 194.63,15.88 195.26,15.24 R45.1 | 185.42,17.78 183.2,17.78 180.89,20.09 180.89,35.65 177.8,38.73 173.35,38.73 168.75,43.34 168.75,95.98 166.31,98.42 U$11.2
  Bottom 0.406: U$11.L1 161.31,99.08 162.56,100.33 164.48,100.33 U$11.2
W11
  Top 0.254: U7.12 193.36,17.78 193.68,18.1 193.68,19.68 193.99,20 R31.1 195.58,20.32 195.58,90.17 193.04,92.71 185.42,92.71 181.55,96.58 U$12.2
  Bottom 0.406: U$12.L1 176.55,99.08 177.8,100.33 179.72,100.33 U$12.2
W12
  Top 0.254: 203.52,17.78 203.2,17.46 203.2,16.19 203.52,15.88 213.04,15.88 213.68,15.24 R47.1 | 203.52,17.78 201.93,17.78 196.79,25.46 U$13.2 | U8.3 203.52,17.78
  Bottom 0.406: U$13.L1 191.79,99.08 193.04,100.33 194.96,100.33 U$13.2
W13
  Top 0.254: R33.1 212.41,20 212.09,19.68 212.09,18.41 211.46,17.78 U8.12 | R33.1 | U$14.2 212.03,98.42 213.68,92.97 R33.1
  Bottom 0.406: U$14.L1 207.03,98.76 208.6,100.33 210.2,100.33 U$14.2
W14
  Top 0.254: U$15.2 227.27,33.08 227.33,33.02 227.33,28.57 224.16,25.4 224.16,18.41 223.52,17.78 U9.3 220.34,17.78 220.03,17.46 220.03,16.51 220.66,15.88 224.47,15.88 225.74,14.61 229.24,14.61 229.56,14.29 R50.1
  Bottom 0.406: U$15.2 227.25,98.5 226.06,100.33 223.47,100.33 U$15.L1
W15
  Top 0.254: U$16.2 242.51,37.72 242.57,37.66 242.57,27.94 237.49,22.86 232.41,22.86 230.82,21.27 R19.1 229.24,17.78 U9.12
  Bottom 0.406: U$16.L1 237.56,98.5 238.76,100.33 241.31,100.33 U$16.2

### Text on the board
tOrigins: S1 | S2
tNames: MIDI | Teensy 3.2 | 74HC4067 | 16 | SCL | SDA | (Korg, Makenoise, etc) | K | Tip is Out / Ring is +5V | Pull ups / ON | K | A | I2C: Tip SDA, Ring SCL / DO NOT HOT PLUG | (Arturia, Novation, etc) | A | Tip is +5V / Ring is Out
bNames: 16 | Sean Hellfritsch / Brian Crabtree / Tom Armitage / Brendon Cassidy / Michigan SynthWorks | v1.31a | CC-BY-SA 4.0 | Creative Commons / Attribution / ShareAlike | (Korg, Makenoise, etc) | Tip is Out / Ring is +5V | K | K | A | (Arturia, Novation, etc) | Tip is +5V / Ring is Out | A